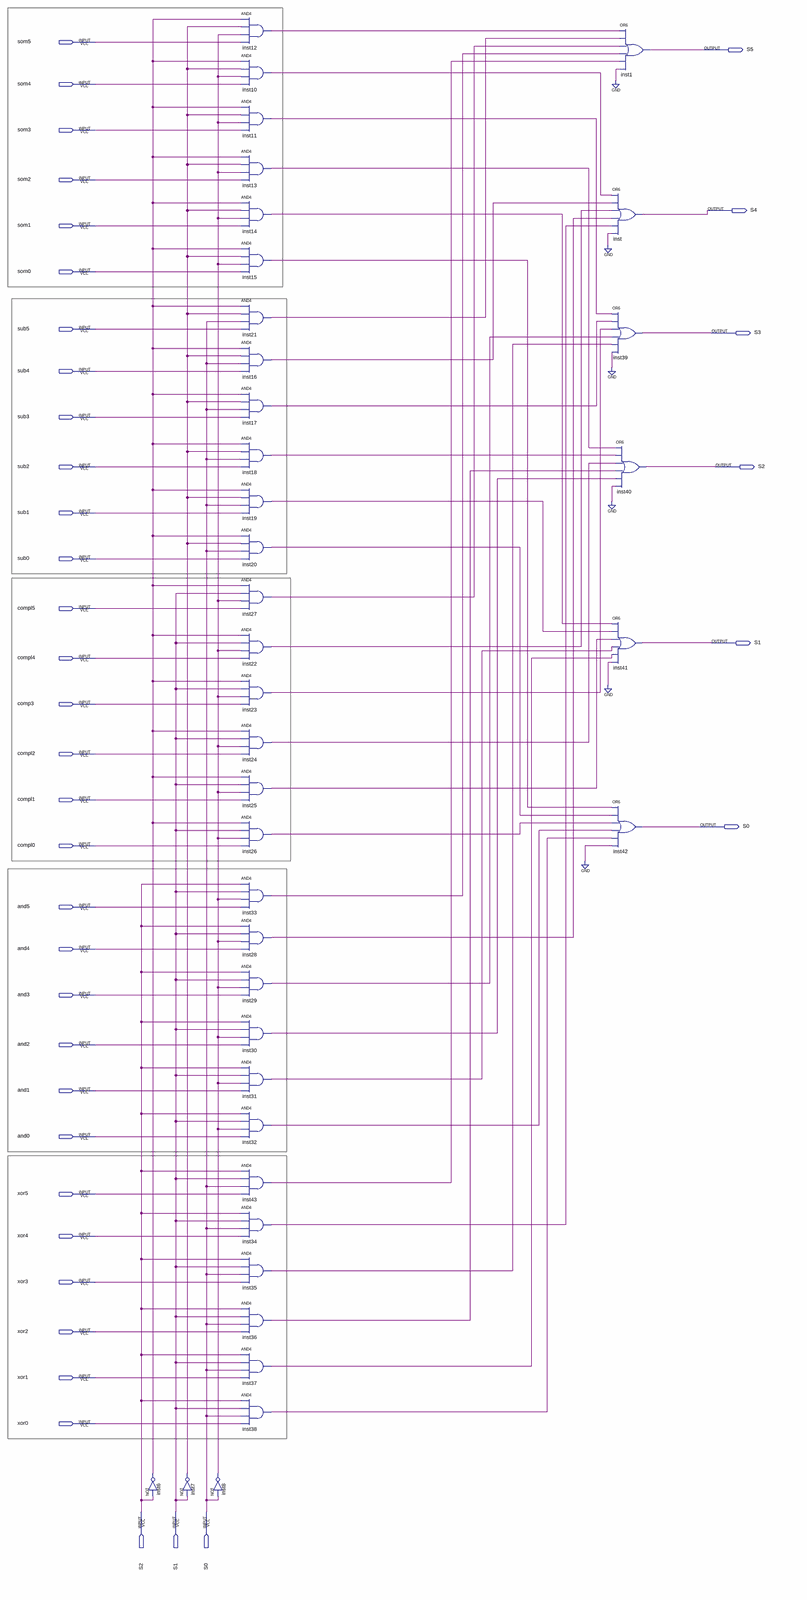
[diagram p0: schematic sheet, whole]
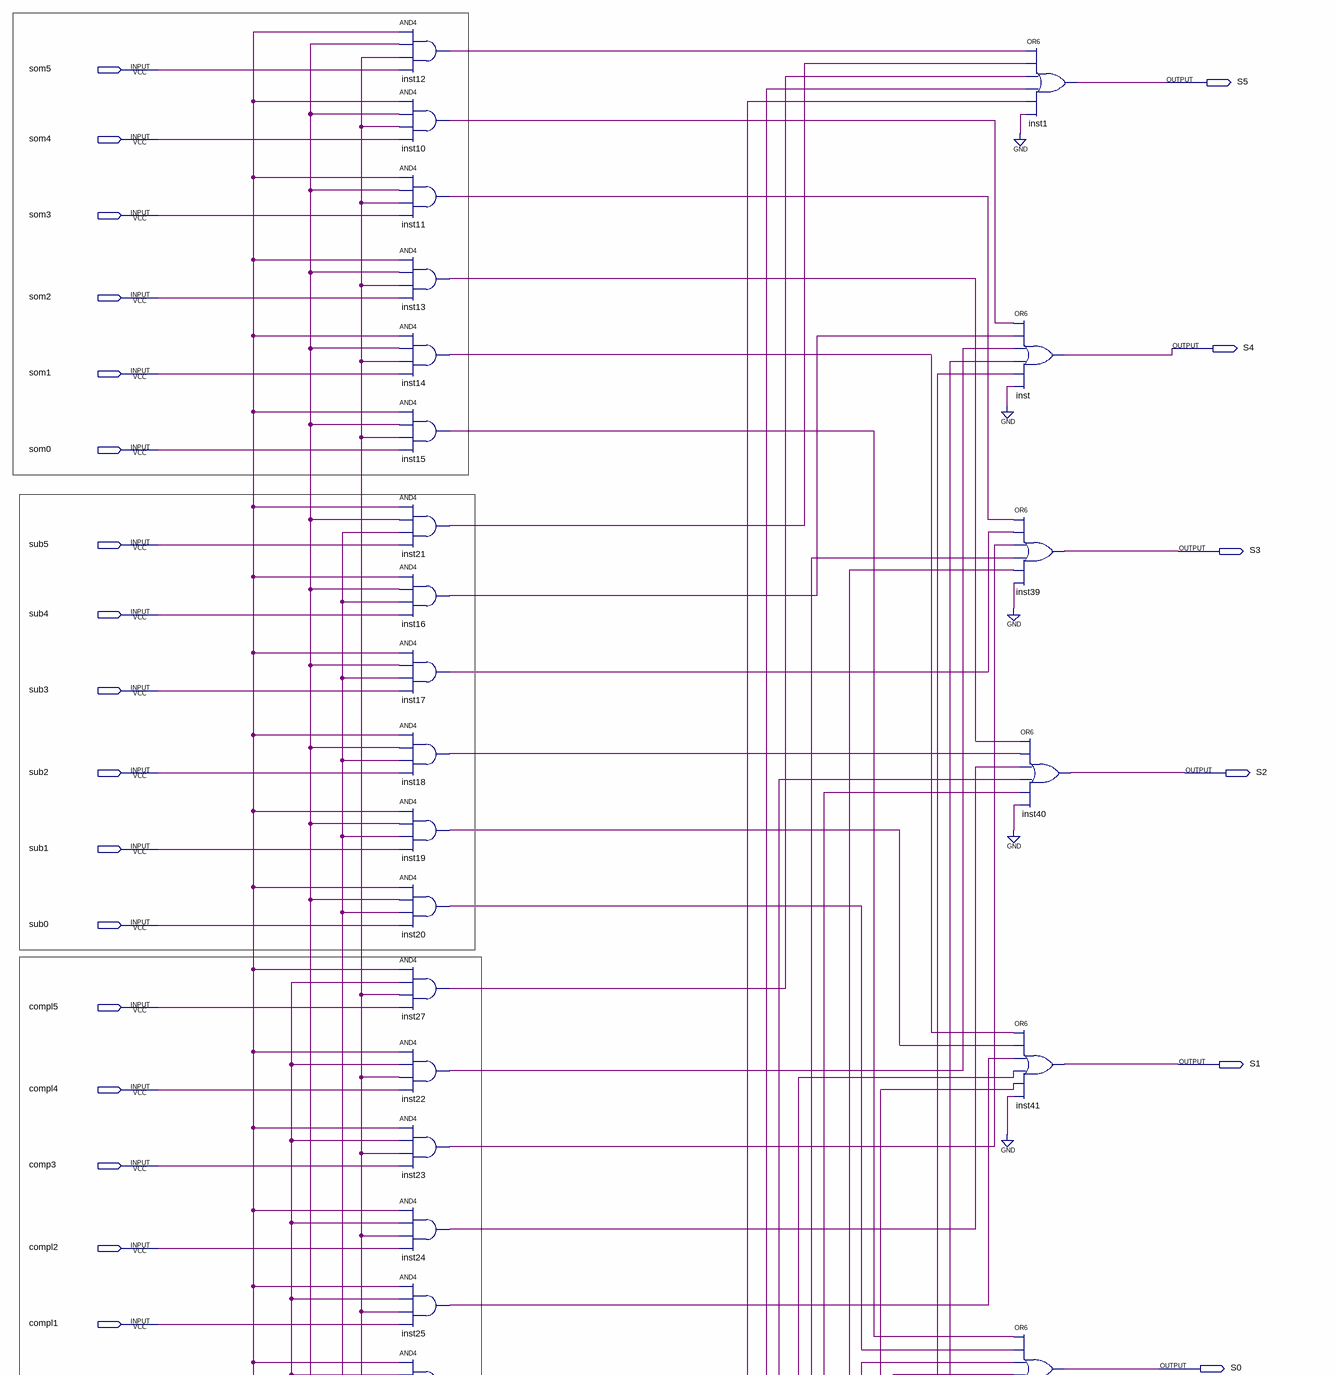
[diagram p1: schematic sheet, upper part]
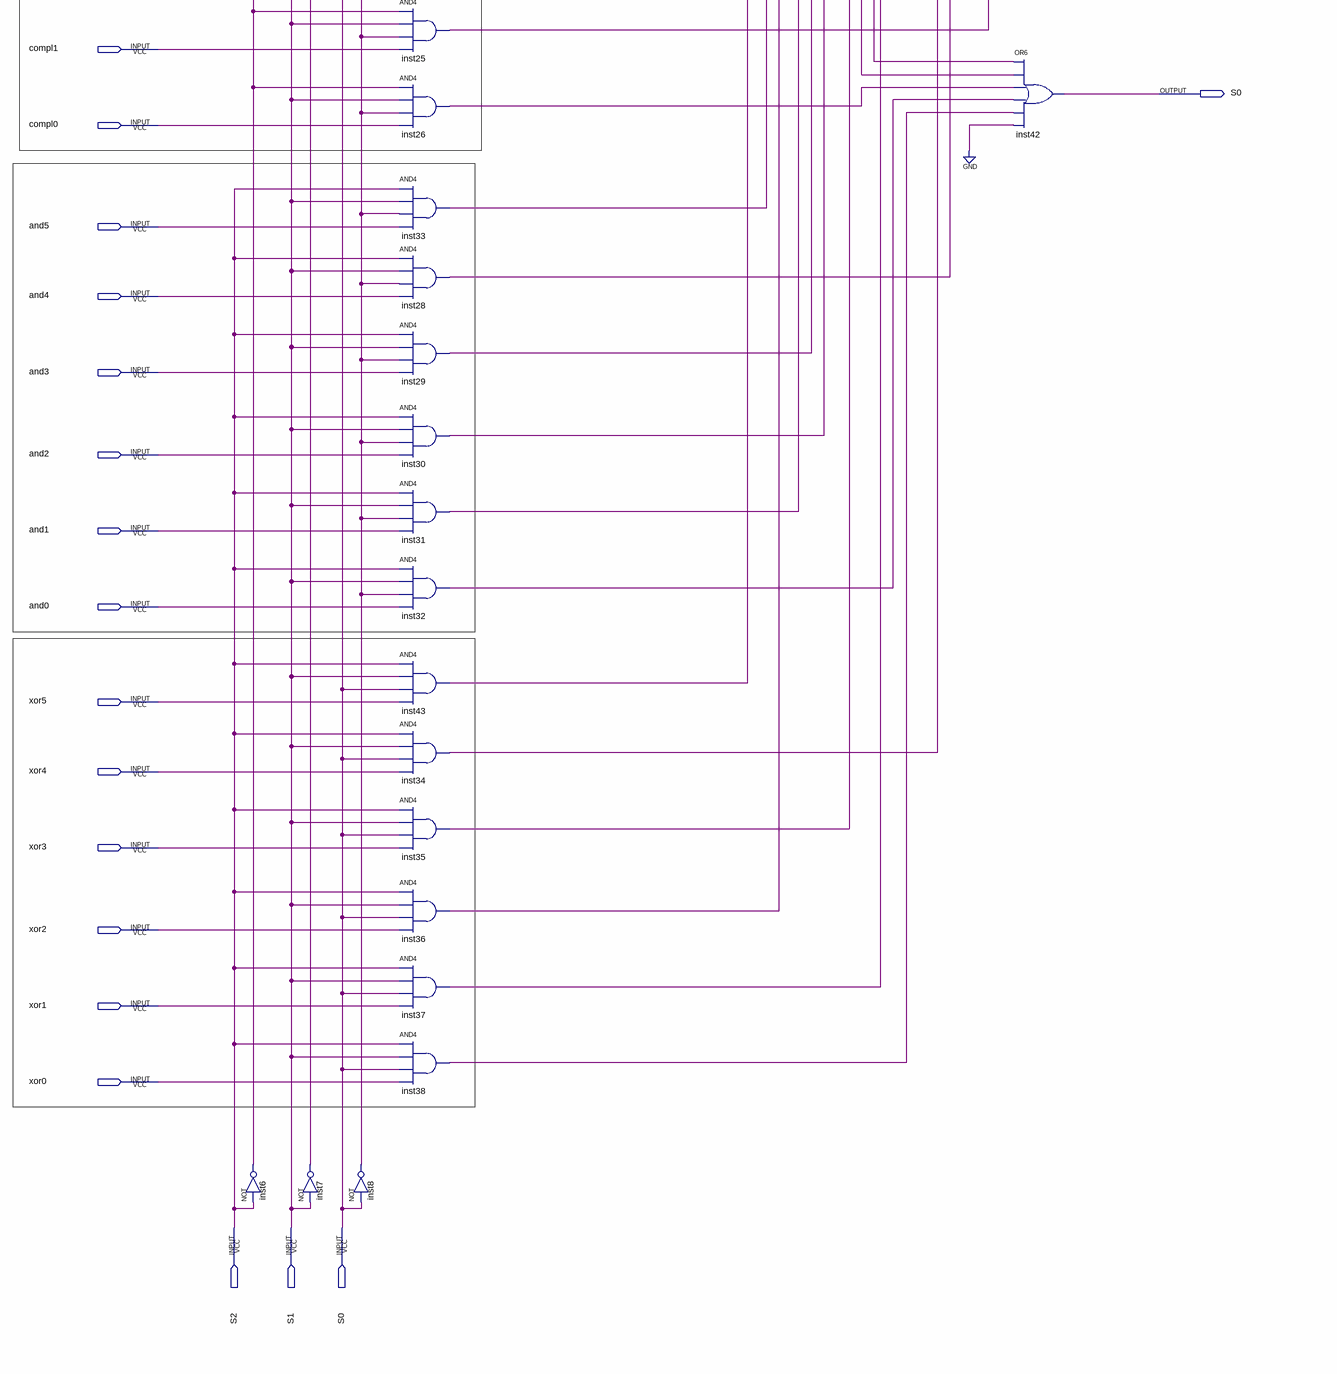
[diagram p2: schematic sheet, lower part]
// Quartus schematic muxsocorro.bdf as structural Verilog: 39 symbols, 39 pins
module muxsocorro (
  input  som5,
  input  som4,
  input  som3,
  input  som2,
  input  som1,
  input  som0,
  input  sub5,
  input  sub4,
  input  sub3,
  input  sub2,
  input  sub1,
  input  sub0,
  input  compl5,
  input  compl4,
  input  comp3,
  input  compl2,
  input  compl1,
  input  compl0,
  input  and5,
  input  and4,
  input  and3,
  input  and2,
  input  and1,
  input  and0,
  input  xor5,
  input  xor4,
  input  xor3,
  input  xor2,
  input  xor1,
  input  xor0,
  inout  S2,
  inout  S1,
  inout  S0,
  output S5,
  output S4,
  output S3
);

  wire inst6_out, inst7_out, inst8_out, inst10_out, inst11_out, inst12_out, inst13_out, inst14_out,
       inst15_out, inst16_out, inst17_out, inst18_out, inst19_out, inst20_out, inst21_out, inst22_out,
       inst23_out, inst24_out, inst25_out, inst26_out, inst27_out, inst28_out, inst29_out, inst30_out,
       inst31_out, inst32_out, inst33_out, inst34_out, inst35_out, inst36_out, inst37_out, inst38_out,
       inst43_out;

  not inst6 (inst6_out, S2);
  not inst7 (inst7_out, S1);
  not inst8 (inst8_out, S0);
  and inst12 (inst12_out, inst6_out, inst7_out, inst8_out, som5);
  and inst10 (inst10_out, inst6_out, inst7_out, inst8_out, som4);
  and inst11 (inst11_out, inst6_out, inst7_out, inst8_out, som3);
  and inst13 (inst13_out, inst6_out, inst7_out, inst8_out, som2);
  and inst14 (inst14_out, inst6_out, inst7_out, inst8_out, som1);
  and inst15 (inst15_out, inst6_out, inst7_out, inst8_out, som0);
  and inst21 (inst21_out, inst6_out, inst7_out, S0, sub5);
  and inst16 (inst16_out, inst6_out, inst7_out, S0, sub4);
  and inst17 (inst17_out, inst6_out, inst7_out, S0, sub3);
  and inst18 (inst18_out, inst6_out, inst7_out, S0, sub2);
  and inst19 (inst19_out, inst6_out, inst7_out, S0, sub1);
  and inst20 (inst20_out, inst6_out, inst7_out, S0, sub0);
  and inst27 (inst27_out, inst6_out, S1, inst8_out, compl5);
  and inst22 (inst22_out, inst6_out, S1, inst8_out, compl4);
  and inst23 (inst23_out, inst6_out, S1, inst8_out, comp3);
  and inst24 (inst24_out, inst6_out, S1, inst8_out, compl2);
  and inst25 (inst25_out, inst6_out, S1, inst8_out, compl1);
  and inst26 (inst26_out, inst6_out, S1, inst8_out, compl0);
  and inst33 (inst33_out, S2, S1, inst8_out, and5);
  and inst28 (inst28_out, S2, S1, inst8_out, and4);
  and inst29 (inst29_out, S2, S1, inst8_out, and3);
  and inst30 (inst30_out, S2, S1, inst8_out, and2);
  and inst31 (inst31_out, S2, S1, inst8_out, and1);
  and inst32 (inst32_out, S2, S1, inst8_out, and0);
  and inst43 (inst43_out, S2, S1, S0, xor5);
  and inst34 (inst34_out, S2, S1, S0, xor4);
  and inst35 (inst35_out, S2, S1, S0, xor3);
  and inst36 (inst36_out, S2, S1, S0, xor2);
  and inst37 (inst37_out, S2, S1, S0, xor1);
  and inst38 (inst38_out, S2, S1, S0, xor0);
  or inst1 (S5, inst12_out, inst21_out, inst27_out, inst33_out, inst43_out, 1'b0);
  or inst (S4, inst10_out, inst16_out, inst22_out, inst28_out, inst34_out, 1'b0);
  or inst39 (S3, inst11_out, inst17_out, inst23_out, inst29_out, inst35_out, 1'b0);
  or inst40 (S2, inst13_out, inst18_out, inst24_out, inst36_out, inst30_out, 1'b0);
  or inst41 (S1, inst14_out, inst19_out, inst25_out, inst31_out, inst37_out, 1'b0);
  or inst42 (S0, inst15_out, inst20_out, inst26_out, inst32_out, inst38_out, 1'b0);
endmodule
